# Altium schematic sheet S3220A2.SchDoc: CPU
size A3; Revision: A; SheetNumber: 2; SheetTotal: 5
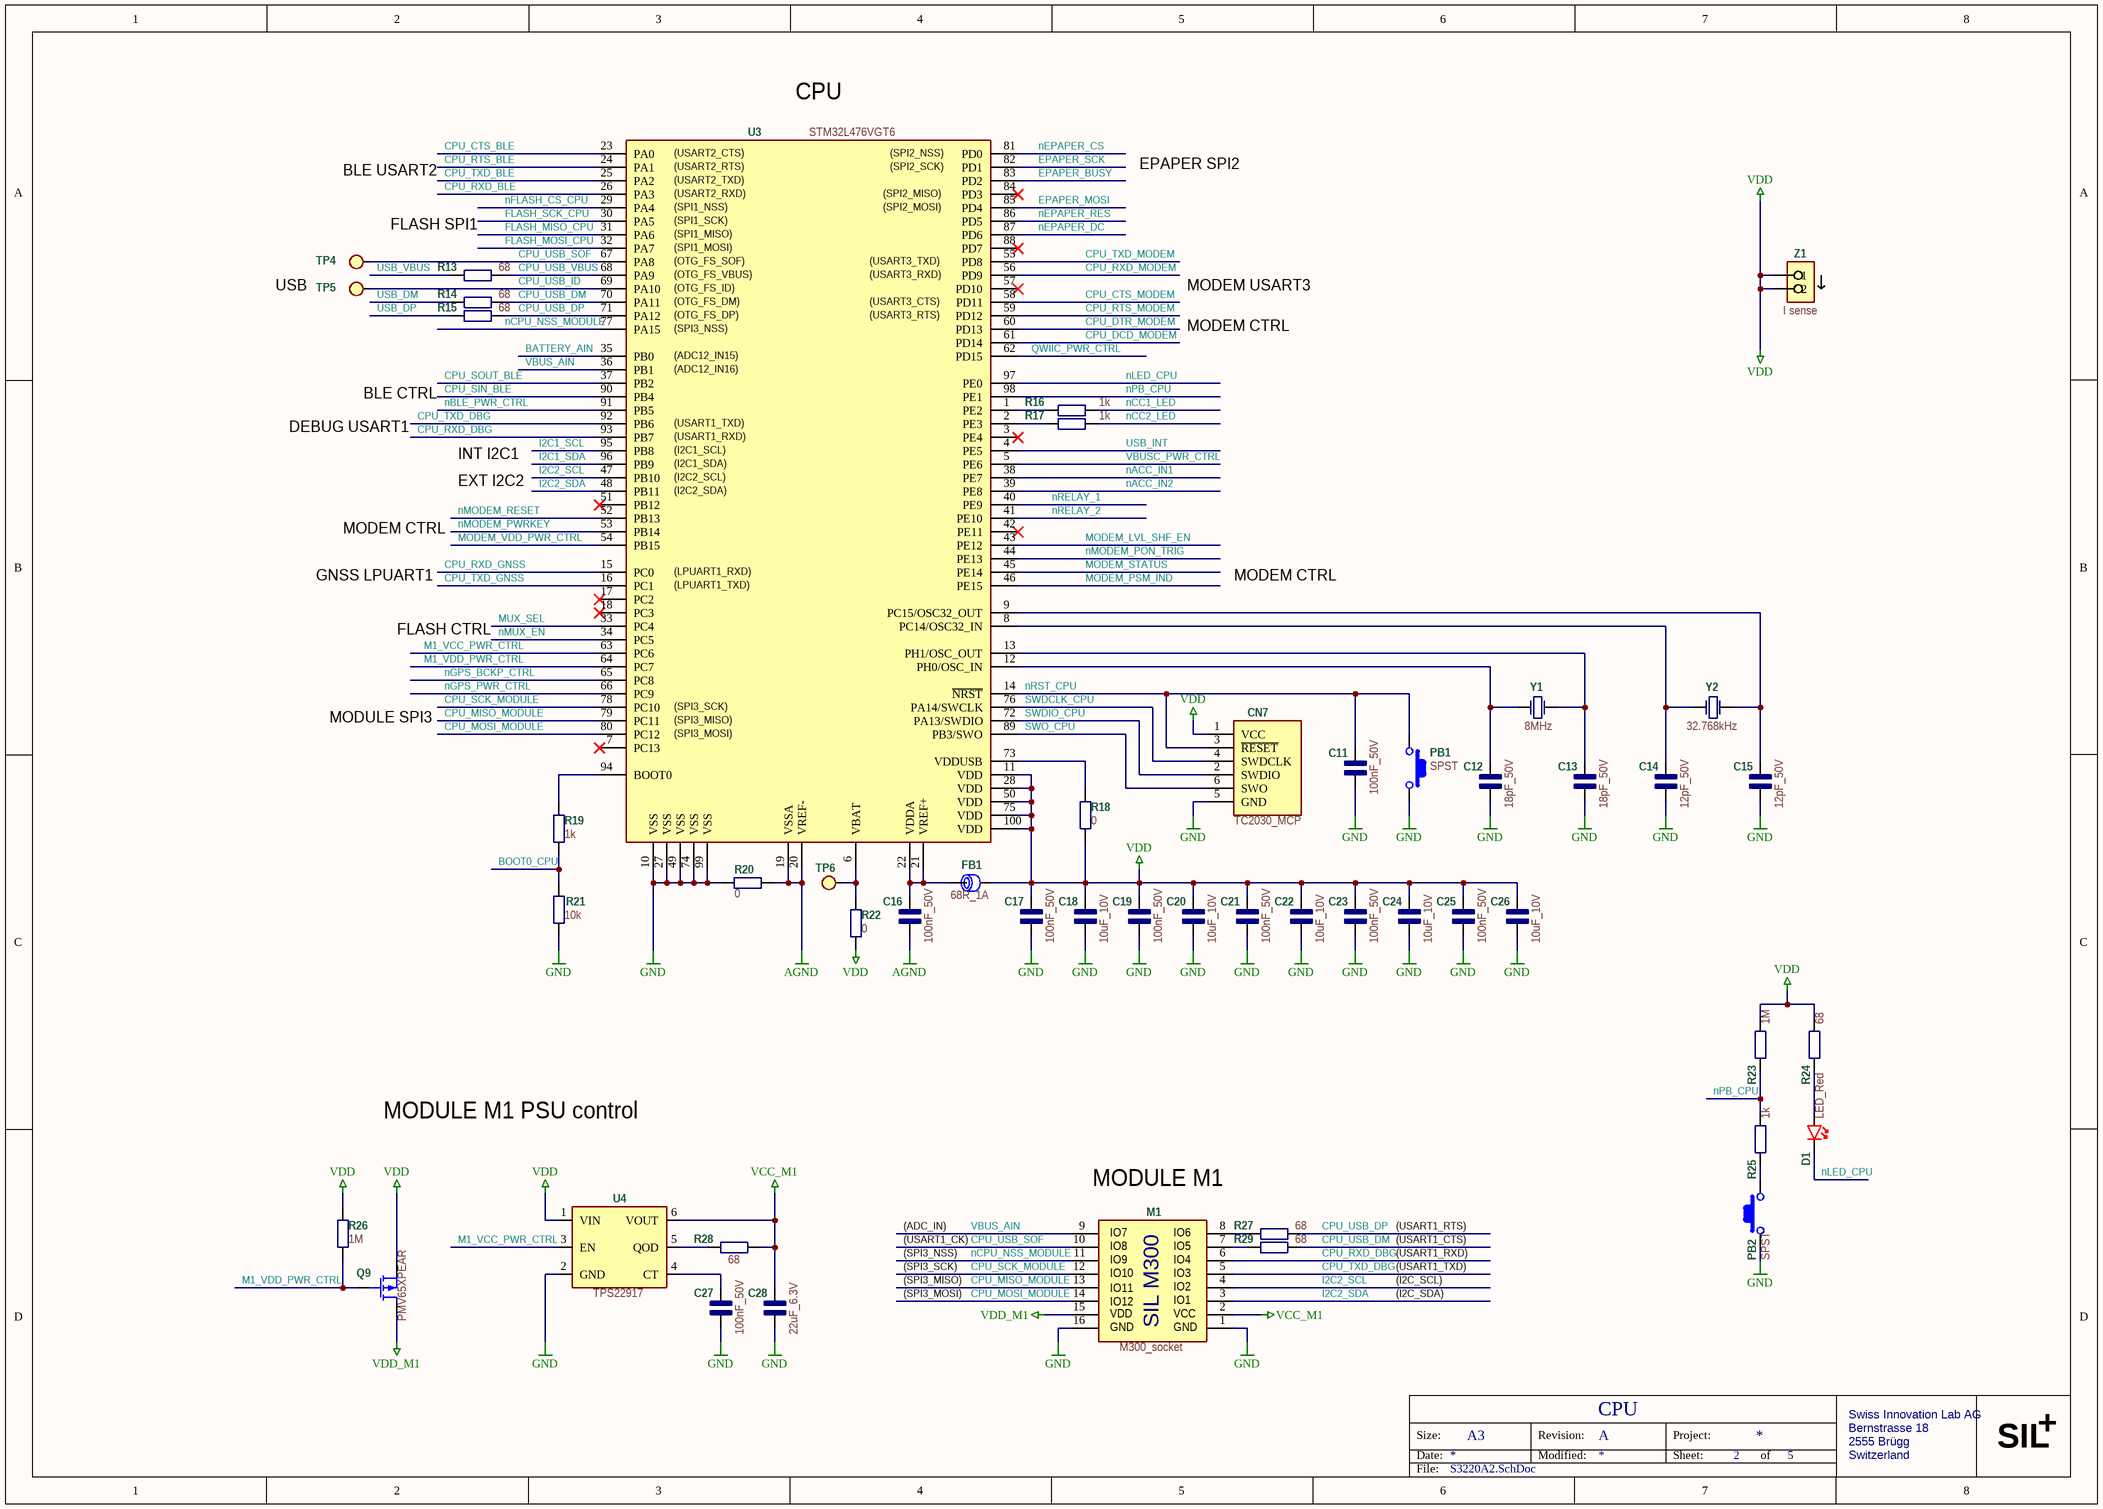
[diagram p0: S3220A2.SchDoc]

## Parts
C11  100nF_50V  [C_0603]
C12  18pF_50V  [C_0603]
C13  18pF_50V  [C_0603]
C14  12pF_50V  [C_0603]
C15  12pF_50V  [C_0603]
C16  100nF_50V  [C_0603]
C17  100nF_50V  [C_0603]
C18  10uF_10V  [C_0603]
C19  100nF_50V  [C_0603]
C20  10uF_10V  [C_0603]
C21  100nF_50V  [C_0603]
C22  10uF_10V  [C_0603]
C23  100nF_50V  [C_0603]
C24  10uF_10V  [C_0603]
C25  100nF_50V  [C_0603]
C26  10uF_10V  [C_0603]
C27  100nF_50V  [C_0603]
C28  22uF_6.3V  [C_0603]
CN7  TC2030_MCP  [CN_TC2030-MCP-NL]  (no BOM)
D1  LED_Red  [LED_0603]
FB1  68R_1A  [L_0603]
M1  M300_socket  [M_M300_socket]  (no BOM)
PB1  SPST  [PB_PTS810]
PB2  SPST  [PB_PTS810]
Q9  PMV65XPEAR  [U_SOT23-3]
R13  68  [R_0603]
R14  68  [R_0603]
R15  68  [R_0603]
R16  1k  [R_0603]
R17  1k  [R_0603]
R18  0  [R_0603]
R19  1k  [R_0603]
R20  0  [R_0603]
R21  10k  [R_0603]
R22  0  [R_0603]
R23  1M  [R_0603]
R24  68  [R_0603]
R25  1k  [R_0603]
R26  1M  [R_0603]
R27  68  [R_0603]
R28  68  [R_0603]
R29  68  [R_0603]
TP4  Test point  [TP_SMD_R1.0mm]  (value not drawn)  (no BOM)
TP5  Test point  [TP_SMD_R1.0mm]  (value not drawn)  (no BOM)
TP6  Test point  [TP_SMD_R1.0mm]  (value not drawn)  (no BOM)
U3  STM32L476VGT6  [U_100-LQFP]
U4  TPS22917  [U_SOT23-6]
Y1  8MHz  [Y_ABMM2]
Y2  32.768kHz  [Y_XTAL-3215]
Z1  I sense  [Z_I_SENSE]  (no BOM)

## Nets
AGND: C16.1 R20.2 U3.19(VSSA) U3.20(VREF-)
GND: C11.1 C12.1 C13.1 C14.1 C15.1 C17.1 C18.1 C19.1 C20.1 C21.1 C22.1 C23.1 C24.1 C25.1 C26.1 C27.1 C28.1 CN7.5(GND) M1.1(GND) M1.16(GND) PB1.1 PB2.2 R20.1 R21.1 U3.10(VSS) U3.27(VSS) U3.49(VSS) U3.74(VSS) U3.99(VSS) U4.2(GND)
VCC_M1: C28.2 M1.2(5V) R28.1 U4.6(VOUT)
VDD: C17.2 C18.2 C19.2 C20.2 C21.2 C22.2 C23.2 C24.2 C25.2 C26.2 CN7.1(VCC) FB1.2 Q9.2(S) R18.2 R22.1 R23.1 R24.2 R26.2 U3.11(VDD) U3.28(VDD) U3.50(VDD) U3.75(VDD) U3.100(VDD) U4.1(VIN) Z1.1 Z1.2
VDD_M1: M1.15(3.3V) Q9.3(D)
BATTERY_AIN: U3.35(PB0)
BOOT0_CPU: R19.1 R21.2
CPU_CTS_BLE: U3.23(PA0)
CPU_CTS_MODEM: U3.58(PD11)
CPU_DCD_MODEM: U3.61(PD14)
CPU_DTR_MODEM: U3.60(PD13)
CPU_MISO_MODULE: M1.13(MISO) U3.79(PC11)
CPU_MOSI_MODULE: M1.14(MOSI) U3.80(PC12)
CPU_RTS_BLE: U3.24(PA1)
CPU_RTS_MODEM: U3.59(PD12)
CPU_RXD_BLE: U3.26(PA3)
CPU_RXD_DBG: M1.6(RX) U3.93(PB7)
CPU_RXD_GNSS: U3.15(PC0)
CPU_RXD_MODEM: U3.56(PD9)
CPU_SCK_MODULE: M1.12(SCK) U3.78(PC10)
CPU_SIN_BLE: U3.90(PB4)
CPU_SOUT_BLE: U3.37(PB2)
CPU_TXD_BLE: U3.25(PA2)
CPU_TXD_DBG: M1.5(TX) U3.92(PB6)
CPU_TXD_GNSS: U3.16(PC1)
CPU_TXD_MODEM: U3.55(PD8)
CPU_USB_DM: R14.2 R29.2 U3.70(PA11)
CPU_USB_DP: R15.2 R27.2 U3.71(PA12)
CPU_USB_ID: TP5.1 U3.69(PA10)
CPU_USB_SOF: M1.10(RST) TP4.1 U3.67(PA8)
CPU_USB_VBUS: R13.2 U3.68(PA9)
EPAPER_BUSY: U3.83(PD2)
EPAPER_MOSI: U3.85(PD4)
EPAPER_SCK: U3.82(PD1)
FLASH_MISO_CPU: U3.31(PA6)
FLASH_MOSI_CPU: U3.32(PA7)
FLASH_SCK_CPU: U3.30(PA5)
I2C1_SCL: U3.95(PB8)
I2C1_SDA: U3.96(PB9)
I2C2_SCL: M1.4(SCL) U3.47(PB10)
I2C2_SDA: M1.3(SDA) U3.48(PB11)
M1_VCC_PWR_CTRL: U3.63(PC6) U4.3(EN)
M1_VDD_PWR_CTRL: Q9.1(G) R26.1 U3.64(PC7)
MODEM_LVL_SHF_EN: U3.43(PE12)
MODEM_PSM_IND: U3.46(PE15)
MODEM_STATUS: U3.45(PE14)
MODEM_VDD_PWR_CTRL: U3.54(PB15)
MUX_SEL: U3.33(PC4)
nACC_IN1: U3.38(PE7)
nACC_IN2: U3.39(PE8)
nBLE_PWR_CTRL: U3.91(PB5)
nCC1_LED: R16.1
nCC2_LED: R17.1
nCPU_NSS_MODULE: M1.11(CS) U3.77(PA15)
nEPAPER_CS: U3.81(PD0)
nEPAPER_DC: U3.87(PD6)
nEPAPER_RES: U3.86(PD5)
nFLASH_CS_CPU: U3.29(PA4)
nGPS_BCKP_CTRL: U3.65(PC8)
nGPS_PWR_CTRL: U3.66(PC9)
nLED_CPU: D1.2(K) U3.97(PE0)
nMODEM_PON_TRIG: U3.44(PE13)
nMODEM_PWRKEY: U3.53(PB14)
nMODEM_RESET: U3.52(PB13)
nMUX_EN: U3.34(PC5)
nPB_CPU: R23.2 R25.2 U3.98(PE1)
nRELAY_1: U3.40(PE9)
nRELAY_2: U3.41(PE10)
nRST_CPU: C11.2 CN7.3(~{RESET}) PB1.2 U3.14(~{NRST})
QWIIC_PWR_CTRL: U3.62(PD15)
SWDCLK_CPU: CN7.4(SWDCLK) U3.76(PA14/SWCLK)
SWDIO_CPU: CN7.2(SWDIO) U3.72(PA13/SWDIO)
SWO_CPU: CN7.6(SWO) U3.89(PB3/SWO)
USB_DM: R14.1
USB_DP: R15.1
USB_INT: U3.4(PE5)
USB_VBUS: R13.1
VBUS_AIN: M1.9(AN) U3.36(PB1)
VBUSC_PWR_CTRL: U3.5(PE6)
NetC12_2: C12.2 U3.12(PH0/OSC_IN) Y1.1(inp)
NetC13_2: C13.2 U3.13(PH1/OSC_OUT) Y1.3(out)
NetC14_2: C14.2 U3.8(PC14/OSC32_IN) Y2.1(inp)
NetC15_2: C15.2 U3.9(PC15/OSC32_OUT) Y2.2(out)
NetC16_2: C16.2 FB1.1 U3.21(VREF+) U3.22(VDDA)
NetC27_2: C27.2 U4.4(CT)
NetD1_1: D1.1(A) R24.1
NetM1_7: M1.7(INT) R29.1
NetM1_8: M1.8(PWM) R27.1
NetPB2_1: PB2.1 R25.1
NetR16_2: R16.2 U3.1(PE2)
NetR17_2: R17.2 U3.2(PE3)
NetR18_1: R18.1 U3.73(VDDUSB)
NetR19_2: R19.2 U3.94(BOOT0)
NetR22_2: R22.2 TP6.1 U3.6(VBAT)
NetR28_2: R28.2 U4.5(QOD)

Not connected (* = marked no-connect by the designer): U3 3(PE4)* 7(PC13)* 17(PC2)* 18(PC3)* 42(PE11)* 51(PB12)* 57(PD10)* 84(PD3)* 88(PD7)*

## Notes on the sheet
- (near U3) CPU
- BLE USART2
- (near U3) (USART2_TXD)
- (near U3) (USART2_CTS)
- (near U3) (USART2_RTS)
- (near U3) (SPI2_SCK)
- (near U3) (SPI2_NSS)
- EPAPER SPI2
- FLASH SPI1
- (near U3) (USART2_RXD)
- (near U3) (SPI1_MISO)
- (near U3) (SPI1_SCK)
- (near U3) (SPI1_NSS)
- (near U3) (SPI2_MOSI)
- (near U3) (SPI2_MISO)
- USB
- (near U3) (SPI1_MOSI)
- (near U3) (OTG_FS_DM)
- (near U3) (OTG_FS_DP)
- (near U3) (OTG_FS_SOF)
- (near U3) (OTG_FS_VBUS)
- (near U3) (OTG_FS_ID)
- (near U3) (USART3_CTS)
- (near U3) (USART3_RTS)
- (near U3) (USART3_TXD)
- (near U3) (USART3_RXD)
- MODEM USART3
- (near U3) (SPI3_NSS)
- (near U3) (ADC12_IN15)
- (near U3) (ADC12_IN16)
- MODEM CTRL
- DEBUG USART1
- BLE CTRL
- (near U3) (USART1_TXD)
- (near U3) (USART1_RXD)
- (near U3) (I2C1_SCL)
- INT I2C1
- EXT I2C2
- (near U3) (I2C2_SCL)
- (near U3) (I2C2_SDA)
- (near U3) (I2C1_SDA)
- GNSS LPUART1
- (near U3) (LPUART1_TXD)
- (near U3) (LPUART1_RXD)
- FLASH CTRL
- MODULE SPI3
- (near U3) (SPI3_SCK)
- (near U3) (SPI3_MISO)
- (near U3) (SPI3_MOSI)
- MODULE M1 PSU control
- (near M1) MODULE M1
- (USART1_CK)
- (SPI3_NSS)
- (ADC_IN)
- (USART1_CTS)
- (USART1_RTS)
- (USART1_RXD)
- (SPI3_SCK)
- (SPI3_MISO)
- (SPI3_MOSI)
- (I2C_SCL)
- (I2C_SDA)
- (USART1_TXD)
- Size:
- Date:
- A3
- Revision:
- Modified:
- Project:
- Sheet:
- of
- Swiss Innovation Lab AG
- Bernstrasse 18
- 2555 Brügg
- Switzerland
- SIL
- +
- File:
- (in symbol M_M300_socket) IO7; IO6; IO8; IO5; IO9; IO4; IO10; IO3; IO11; IO2; IO12; IO1; VDD; VCC; SIL M300

## Library data of the parts
C11 C16 C17 C19 C21 C23 C25 C27 = C_100nF_50V: 0.1µF ±10% 50V Ceramic Capacitor X7R 0603 (1608 Metric); Manufacturer: TDK; Manufacturer Part Number: C1608X7R1H104K080AA; Value: 100nF; ValueAux: _50V; Currency: $; Price: 0,01309; Supplier 1: Digi-Key; Supplier Part Number 1: 445-1314-6-ND
C12 C13 = C_18pF_50V: 18pF ±5% 50V Ceramic Capacitor C0G, NP0 0603 (1608 Metric); Manufacturer: KEMET; Manufacturer Part Number: C0603C180J5GACTU; ValueAux: _50V; Currency: $; Value: 18pF; Price: 0,00974; Supplier 1: Digi-Key; Supplier Part Number 1: 399-1052-1-ND
C14 C15 = C_12pF_50V: 12pF ±1% 50V Ceramic Capacitor C0G, NP0 0603 (1608 Metric); Manufacturer: Samsung Electro-Mechanics; Manufacturer Part Number: CL10C120FB8NNNC; ValueAux: _50V; Currency: $; Value: 12pF; Price: 0,05153; Supplier 1: Digi-Key; Supplier Part Number 1: 1276-2175-1-ND
C18 C20 C22 C24 C26 = C_10uF_10V: 10µF ±10% 10V Ceramic Capacitor X5R 0603 (1608 Metric); Manufacturer: Murata Electronics North America; Manufacturer Part Number: GRM188R61A106KE69D; Value: 10uF; ValueAux: _10V; Currency: $; Price: 0,03994; Supplier 1: Digi-Key; Supplier Part Number 1: 490-10474-1-ND
C28 = C_22uF_6V3: 22µF ±20% 6.3V Ceramic Capacitor X5R 0603 (1608 Metric); Manufacturer: Samsung Electro-Mechanics; Manufacturer Part Number: CL10A226MQ8NRNC; Value: 22uF; ValueAux: _6.3V; Currency: $; Price: 0,04566; Supplier 1: Digi-Key; Supplier Part Number 1: 1276-1193-1-ND
CN7 = CN_TC2030: TC2030-MCP-NL; Value: TC2030; ValueAux: _MCP; Currency: $; Price: 0
D1 = D_LED_R_5mA: Red 631nm LED Indication - Discrete 2V 0603; Manufacturer: Lite-On Inc.; Manufacturer Part Number: LTST-C193KRKT-5A; ValueAux: _Red; Currency: $; Value: LED; Price: 0,07565; Supplier 1: Digi-Key; Supplier Part Number 1: 160-1830-1-ND
FB1 = FB_68R_1A: FERRITE BEAD 68 OHM 0603 1LN; Manufacturer: Laird-Signal Integrity Products; Manufacturer Part Number: MI0603J680R-10; Value: 68R; ValueAux: _1A; Currency: $; Price: 0,02658; Supplier 1: Digi-Key; Supplier Part Number 1: 240-2372-1-ND
M1 = M_M300_socket: Module M300 motherboard socket; Manufacturer: Swiss Innovation Lab; Currency: $; Value: M300; ValueAux: _socket; Manufacturer Part Number: M300; Price: 0; Supplier 1: Swiss Innovation Lab; Supplier Part Number 1: M300
PB1 PB2 = PB_SPST_2.5mm: Tactile Switch SPST-NO Top Actuated Surface Mount; Manufacturer: C&K; Manufacturer Part Number: PTS810 SJM 250 SMTR LFS; Currency: $; Value: SPST; Price: 0,17302; Supplier 1: Digi-Key; Supplier Part Number 1: CKN10502DKR-ND
Q9 = Q_PMV65: P-Channel 20V 2.8A (Ta) 480mW (Ta), 6.25W (Tc) Surface Mount TO-236AB (SOT23); Manufacturer: Nexperia USA Inc.; Currency: $; Value: PMV65XPEAR; Manufacturer Part Number: PMV65XPEAR; Price: 0,11204; Supplier 1: Digi-Key; Supplier Part Number 1: 1727-2310-1-ND
R13-R15 R24 R27-R29 = R_68_1%: 68 Ohms ±1% 0.1W, 1/10W Chip Resistor 0603 (1608 Metric) Automotive AEC-Q200 Thick Film; Manufacturer: Panasonic Electronic Components; Manufacturer Part Number: ERJ-3EKF68R0V; Currency: $; Value: 68; Price: 0,01449; Supplier 1: Digi-Key; Supplier Part Number 1: P68.0HCT-ND
R16 R17 R19 R25 = R_1k_1%: 1 kOhms ±1% 0.1W, 1/10W Chip Resistor 0603 (1608 Metric) Automotive AEC-Q200 Thick Film; Manufacturer: Panasonic Electronic Components; Manufacturer Part Number: ERJ-3EKF1001V; Currency: $; Value: 1k; Price: 0,01153; Supplier 1: Digi-Key; Supplier Part Number 1: P1.00KHCT-ND
R18 R20 R22 = R_0_1%: 0 Ohms Jumper 0.1W, 1/10W Chip Resistor 0603 (1608 Metric) Automotive AEC-Q200 Thick Film; Manufacturer: Panasonic Electronic Components; Manufacturer Part Number: ERJ-3GEY0R00V; Currency: $; Value: 0; Price: 0,00962; Supplier 1: Digi-Key; Supplier Part Number 1: P0.0GCT-ND
R21 = R_10k_1%: 10 kOhms ±1% 0.1W, 1/10W Chip Resistor 0603 (1608 Metric) Automotive AEC-Q200 Thick Film; Manufacturer: Panasonic Electronic Components; Manufacturer Part Number: ERJ-3EKF1002V; Currency: $; Value: 10k; Price: 0,01449; Supplier 1: Digi-Key; Supplier Part Number 1: P10.0KHCT-ND
R23 R26 = R_1M_1%: 1 MOhms ±1% 0.1W, 1/10W Chip Resistor 0603 (1608 Metric) Automotive AEC-Q200 Thick Film; Manufacturer: Panasonic Electronic Components; Manufacturer Part Number: ERJ-3EKF1004V; Currency: $; Value: 1M; Price: 0,01264; Supplier 1: Digi-Key; Supplier Part Number 1: P1.00MHCT-ND
TP4-TP6 = TP_Test_point: Manufacturer: Swiss Innovation Lab; Currency: $; Value: Test point; Manufacturer Part Number: Test point; Price: 0
U3 = U_STM32L476: ARM® Cortex®-M4 STM32L4 Microcontroller IC 32-Bit 80MHz 1MB (1M x 8) FLASH 100-LQFP (14x14); Manufacturer: STMicroelectronics; Currency: $; Value: STM32L476VGT6; Manufacturer Part Number: STM32L476VGT6; Price: 5,98590; Supplier 1: Digi-Key; Supplier Part Number 1: 497-15873-ND
U4 = U_TPS22917: Power Switch/Driver 1:1 P-Channel 2A SOT-23-6; Manufacturer: Texas Instruments; Manufacturer Part Number: TPS22917DBVR; Currency: $; Value: TPS22917; Price: 0,19065; Supplier 1: Digi-Key; Supplier Part Number 1: 296-50498-1-ND
Y1 = Y_8MHz_20ppm: 8MHz ±20ppm Crystal 18pF 72 Ohms 4-SMD, No Lead; Manufacturer: Abracon LLC; Manufacturer Part Number: ABMM2-8.000MHZ-E2-T; Currency: $; Value: 8MHz; Price: 0,49500; Supplier 1: Digi-Key; Supplier Part Number 1: 535-9628-1-ND
Y2 = Y_32kHz_10ppm: 32.768kHz ±10ppm Crystal 12.5pF 70 kOhms 2-SMD, No Lead; Manufacturer: ECS Inc.; Manufacturer Part Number: ECS-.327-12.5-34B-C-TR; Currency: $; Value: 32.768kHz; Price: 0,42900; Supplier 1: Digi-Key; Supplier Part Number 1: XC1968CT-ND
Z1 = Z_I_sense: 2 Positions Header Connector 0.100" (2.54mm) SMD Gold for current measurement; Manufacturer: SIL; Currency: $; Value: I sense; Manufacturer Part Number: I sense; Price: 0; Supplier 1: SIL; Supplier Part Number 1: I sense